# EAGLE design input (EAGLE 9.6.2)
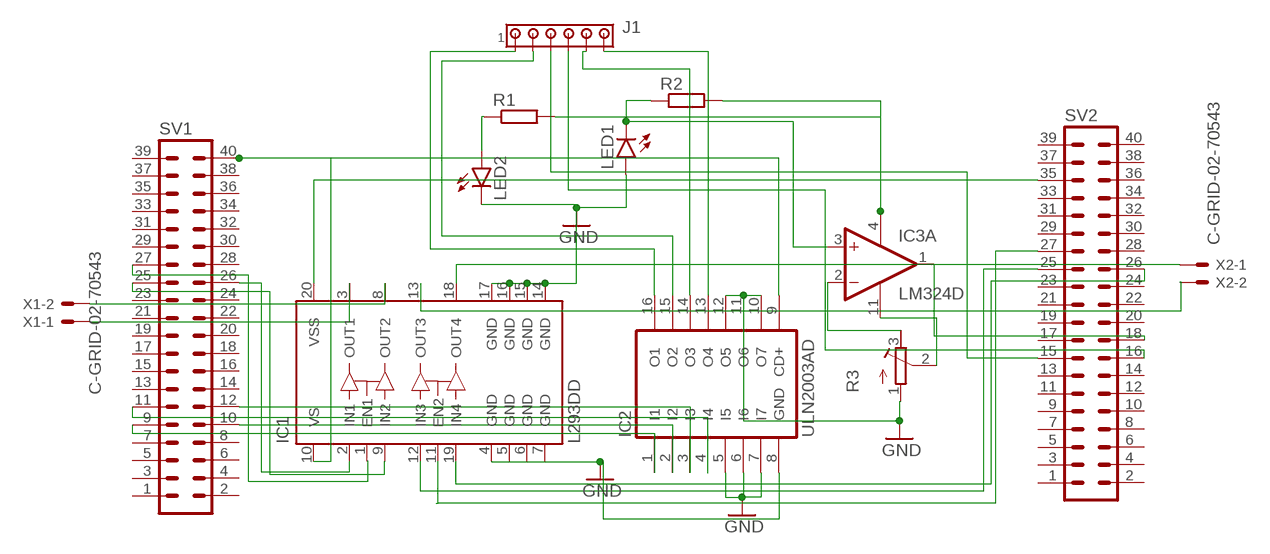
[diagram p0: schematic, sheet 1]

## Parts
IC1  L293DD  [SO20]
IC2  ULN2003AD  [SO16]
IC3  LM324D  [SO14]
J1  MTA06-100  [10X06MTA]
LED1  LED5MM  [LED5MM]
LED2  LED5MM  [LED5MM]
R1  R-EU_R0201  [R0201]
R2  R-EU_R0201  [R0201]
R3  R-TRIMM3103  [RTRIM3103]
SV1  40P  [40P]
SV2  40P  [40P]
X1  C-GRID-02-70543  [70543-02]
X2  C-GRID-02-70543  [70543-02]

## Nets
GND: IC1.4(GND) IC1.14(GND) IC1.15(GND) IC1.16(GND) IC1.17(GND) IC2.5(I5) IC2.6(I6) IC2.7(I7) IC2.8(GND) IC2.10(O7) IC2.11(O6) IC2.12(O5) LED1.A LED2.K(C) R3.1(A)
N$1: IC3.3(A:+IN) LED1.K(C) R2.1
N$2: LED2.A R1.1
N$3: IC3.11(P:V-) R3.2(S)
N$4: IC3.2(A:-IN) R3.3(E)
N$5: IC2.1(I1) SV1.9
N$6: IC2.2(I2) SV1.10
N$7: IC2.3(I3) SV1.12
N$8: IC1.2(IN1) SV1.26
N$9: IC1.9(IN2) SV1.25
N$10: IC1.1(EN1) SV1.27
N$11: IC1.12(IN3) SV2.25
N$12: IC1.19(IN4) SV2.26
N$13: IC1.11(EN2) SV2.27
N$14: IC1.3(OUT1) X1.1
N$15: IC1.8(OUT2) X1.2
N$16: IC1.10(VS) IC2.9(CD+) SV1.40
N$17: IC1.20(VSS) SV2.35
N$18: IC2.4(I4) SV1.11
N$19: IC1.18(OUT4) X2.1
N$20: IC1.13(OUT3) X2.2
N$21: IC2.16(O1) J1.1
N$22: IC2.15(O2) J1.2
N$23: IC2.14(O3) J1.5
N$24: IC2.13(O4) J1.6
N$25: IC3.4(P:V+) R1.2 R2.2
N$26: IC3.1(A:OUT) SV2.18
N$27: J1.3 SV2.15
N$28: J1.4 SV2.16
Unconnected: IC3.5(B:+IN) IC3.6(B:-IN) IC3.7(B:OUT) IC3.8(C:OUT) IC3.9(C:-IN) IC3.10(C:+IN) IC3.12(D:+IN) IC3.13(D:-IN) IC3.14(D:OUT) SV1.1 SV1.2 SV1.3 SV1.4 SV1.5 SV1.6 SV1.7 SV1.8 SV1.13 SV1.14 SV1.15 SV1.16 SV1.17 SV1.18 SV1.19 SV1.20 SV1.21 SV1.22 SV1.23 SV1.24 SV1.28 SV1.29 SV1.30 SV1.31 SV1.32 SV1.33 SV1.34 SV1.35 SV1.36 SV1.37 SV1.38 SV1.39 SV2.1 SV2.2 SV2.3 SV2.4 SV2.5 SV2.6 SV2.7 SV2.8 SV2.9 SV2.10 SV2.11 SV2.12 SV2.13 SV2.14 SV2.17 SV2.19 SV2.20 SV2.21 SV2.22 SV2.23 SV2.24 SV2.28 SV2.29 SV2.30 SV2.31 SV2.32 SV2.33 SV2.34 SV2.36 SV2.37 SV2.38 SV2.39 SV2.40

## Power pins joined to a net without a drawn wire
GND: IC1.5(GND) IC1.6(GND) IC1.7(GND)

## Library data of the parts
IC1 = st-microelectronics:L293DD: PUSH-PULL FOUR CHANNEL DRIVER WITH DIODES Source: http://www.st.com/stonline/books/pdf/docs/1330.pdf; OC_FARNELL: unknown
IC2 = uln-udn:ULN2003A: DRIVER ARRAY
IC3 = linear:LM324: OP AMP
J1 = con-amp:MTA06-100: AMP connector Connection corrected 2014-09-19
LED1 LED2 = led:LED: LED OSRAM: - CHIPLED LG R971, LG N971, LY N971, LG Q971, LY Q971, LO R971, LY R971 LH N974, LH R974 LS Q976, LO Q976, LY Q976 LO Q996 - Hyper CHIPLED LW Q18S LB Q993, LB Q99A, LB R99A - SideLED LS A670, LO A670, LY A670, LG A670, LP A670 LB A673, LV A673, LT A673, LW A673 LH A674 LY A675 LS A676, LA A676, LO A676, LY A676, LW A676 LS A679, LY A679, LG A679 - Hyper Micro SIDELED® LS Y876, LA Y876, LO Y876, LY Y876 LT Y87S - SmartLED LW L88C, LW L88S LB L89C, LB L89S, LG L890 LS L89K, LO L89K, LY L89K LS L896, LA L896, LO L896, LY L896 - TOPLED LS T670, LO T670, LY T670, LG T670, LP T670 LSG T670, LSP T670, LSY T670, LOP T670, LYG T670 LG T671, LOG T671, LSG T671 LB T673, LV T673, LT T673, LW T673 LH T674 LS T676, LA T676, LO T676, LY T676, LB T676, LH T676, LSB T676, LW T676 LB T67C, LV T67C, LT T67C, LS T67K, LO T67K, LY T67K, LW E67C LS E67B, LA E67B, LO E67B, LY E67B, LB E67C, LV E67C, LT E67C LW T67C LS T679, LY T679, LG T679 LS T770, LO T770, LY T770, LG T770, LP T770 LB T773, LV T773, LT T773, LW T773 LH T774 LS E675, LA E675, LY E675, LS T675 LS T776, LA T776, LO T776, LY T776, LB T776 LHGB T686 LT T68C, LB T68C - Hyper Mini TOPLED® LB M676 - Mini TOPLED Santana® LG M470 LS M47K, LO M47K, LY M47K Source: http://www.osram.convergy.de LUXEON: - LUMILED® LXK2-PW12-R00, LXK2-PW12-S00, LXK2-PW14-U00, LXK2-PW14-V00 LXK2-PM12-R00, LXK2-PM12-S00, LXK2-PM14-U00 LXK2-PE12-Q00, LXK2-PE12-R00, LXK2-PE12-S00, LXK2-PE14-T00, LXK2-PE14-U00 LXK2-PB12-K00, LXK2-PB12-L00, LXK2-PB12-M00, LXK2-PB14-N00, LXK2-PB14-P00, LXK2-PB14-Q00 LXK2-PR12-L00, LXK2-PR12-M00, LXK2-PR14-Q00, LXK2-PR14-R00 LXK2-PD12-Q00, LXK2-PD12-R00, LXK2-PD12-S00 LXK2-PH12-R00, LXK2-PH12-S00 LXK2-PL12-P00, LXK2-PL12-Q00, LXK2-PL12-R00 Source: www.luxeon.com KINGBRIGHT: KA-3528ASYC Source: www.kingbright.com
R1 R2 = rcl:R-EU_: RESISTOR, European symbol; SPICEPREFIX: R
R3 = rcl:R-TRIMM: Trimm resistor; SPICEMODEL: X; SPICEPREFIXL: POT
SV1 SV2 = con-dil:40P: DIL CABLE CONNECTOR
X1 X2 = con-molex:C-GRID-02: CONNECTOR wire to board 2.54 mm (0.100") pitch header; MF: MOLEX; OC_FARNELL: unknown; OC_NEWARK: unknown

## Board
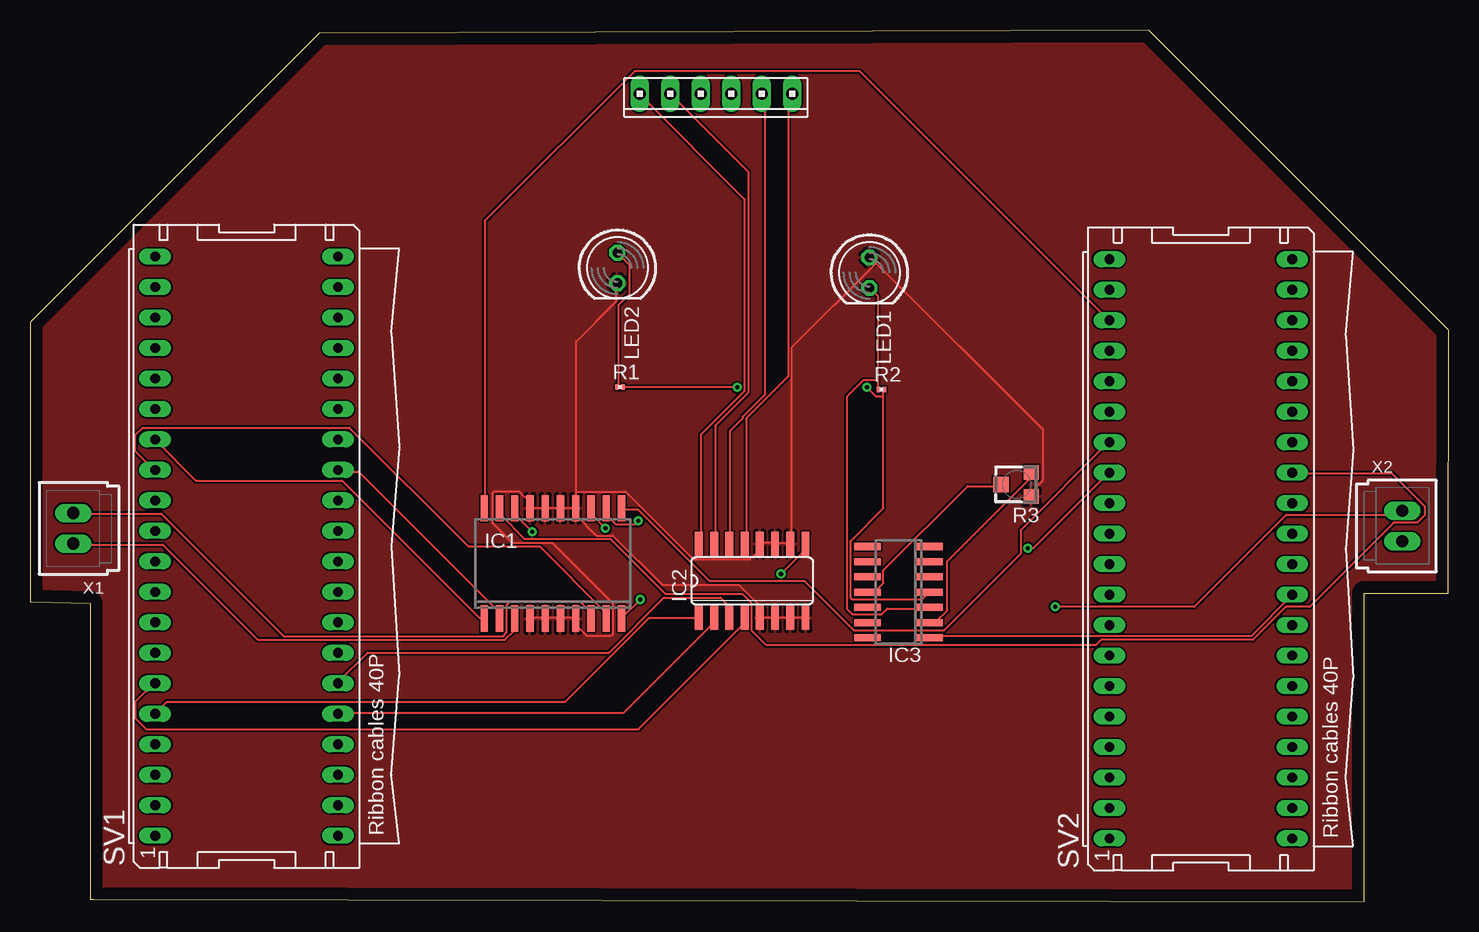
[diagram p1: board, top side]
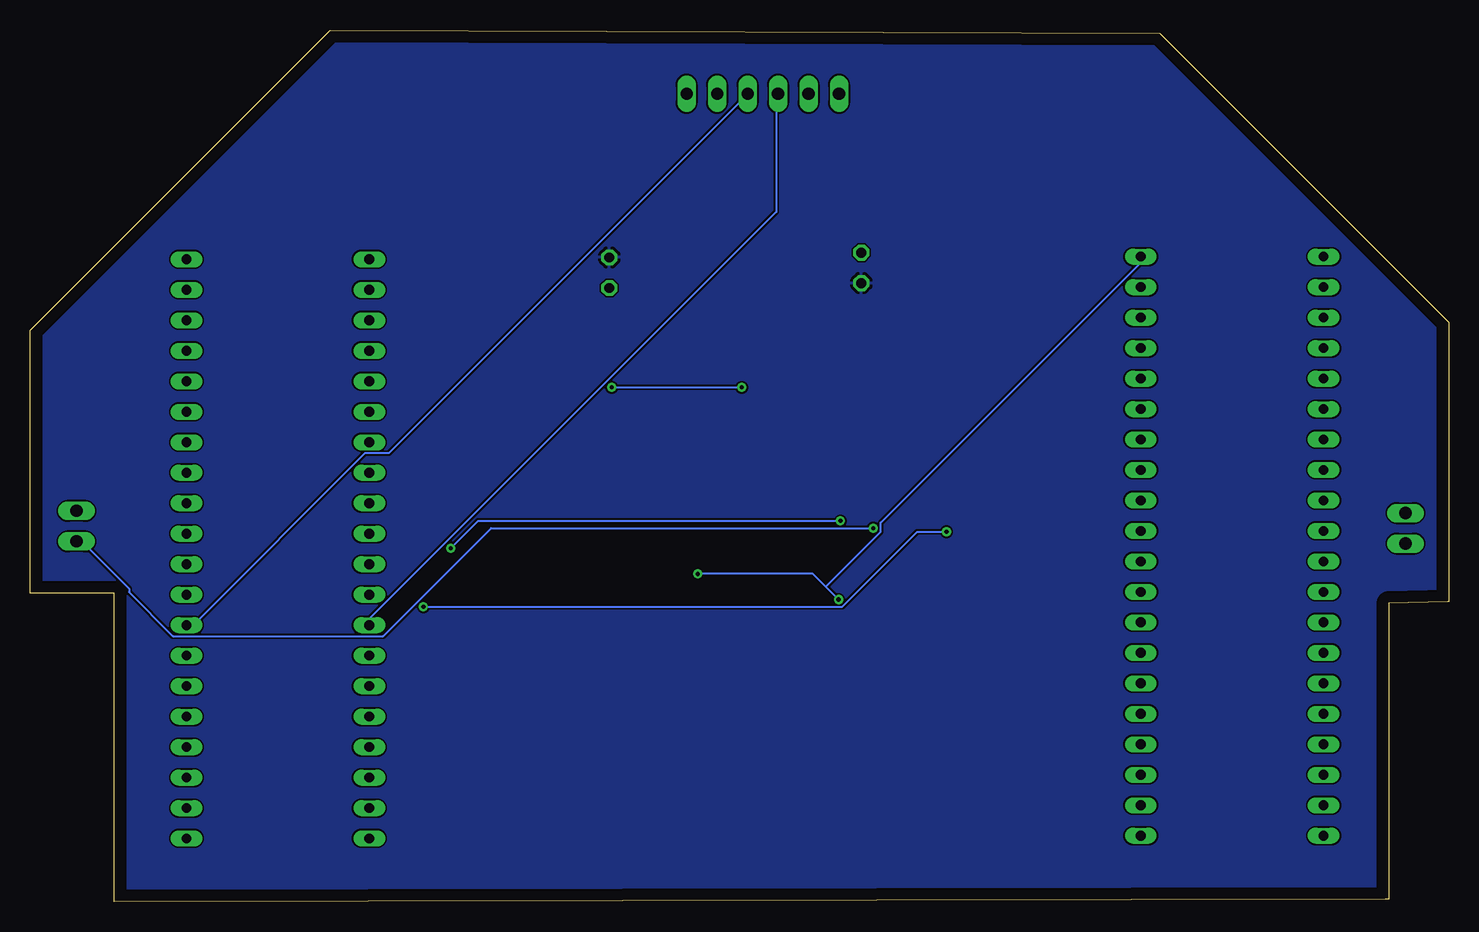
[diagram p2: board, bottom side, seen from below]

Size 118.23 x 72.65 mm. Coordinates in mm from the lower left corner, seen from the top.
Outline: 0,48.31 0,25 0.1,25 5,24.9 5,0.2 5.3,0.2 111.2,0 111.2,25.7 118.2,25.7 118.23,47.63 93.23,72.65 24.09,72.38 0,48.31
Copper layers (1*16): Top 0.035mm / dielectric 1.5mm / Bottom 0.035mm
Design rules "default": minimum track width 6mil, minimum drill 0.35mm, track to track 6mil, track to pad 6mil, pad to pad 6mil, via to via 6mil, smd to smd 6mil, copper to edge 40mil, drill to drill 6mil, minimum pad ring 10mil, minimum via ring 8mil, stop-mask expansion 4mil, vias tented up to drill 0mil, thermal gap 10mil

### Footprints (pad centres in the part's own frame; a part is rotated, then mirrored left to right if it is on the bottom)
SO20 = smd 0.6 x 2.2: 1 -5.715,-4.6; 2 -4.445,-4.6; 3 -3.175,-4.6; 4 -1.905,-4.6; 5 -0.635,-4.6; 6 0.635,-4.6; 7 1.905,-4.6; 8 3.175,-4.6; 9 4.445,-4.6; 10 5.715,-4.6; 11 5.715,4.6; 12 4.445,4.6; 13 3.175,4.6; 14 1.905,4.6; 15 0.635,4.6; 16 -0.635,4.6; 17 -1.905,4.6; 18 -3.175,4.6; 19 -4.445,4.6; 20 -5.715,4.6
SO16 = smd 0.66 x 2.032: 1 -4.445,-3.073; 2 -3.175,-3.073; 3 -1.905,-3.073; 4 -0.635,-3.073; 5 0.635,-3.073; 6 1.905,-3.073; 7 3.175,-3.073; 8 4.445,-3.073; 9 4.445,3.073; 10 3.175,3.073; 11 1.905,3.073; 12 0.635,3.073; 13 -0.635,3.073; 14 -1.905,3.073; 15 -3.175,3.073; 16 -4.445,3.073
SO14 = smd 0.6 x 2.2: 1 -3.81,-2.6; 2 -2.54,-2.6; 3 -1.27,-2.6; 4 0,-2.6; 5 1.27,-2.6; 6 2.54,-2.6; 7 3.81,-2.6; 8 3.81,2.6; 9 2.54,2.6; 10 1.27,2.6; 11 0,2.6; 12 -1.27,2.6; 13 -2.54,2.6; 14 -3.81,2.6
10X06MTA = drill 1.016 long: 1 6.35,0; 2 3.81,0; 3 1.27,0; 4 -1.27,0; 5 -3.81,0; 6 -6.35,0
LED5MM = drill 0.813 octagon: A -1.27,0; K 1.27,0
R0201 = smd 0.28 x 0.43: 1 -0.255,0; 2 0.255,0
RTRIM3103 = smd 1.2 x 1.25: 1 -1,-1.225; 3 1,-1.225 | smd 1.3 x 1.3: 2 0,1.3
40P = drill 0.813 long: 1 -24.13,7.62; 2 -24.13,-7.62; 3 -21.59,7.62; 4 -21.59,-7.62; 5 -19.05,7.62; 6 -19.05,-7.62; 7 -16.51,7.62; 8 -16.51,-7.62; 9 -13.97,7.62; 10 -13.97,-7.62; 11 -11.43,7.62; 12 -11.43,-7.62; 13 -8.89,7.62; 14 -8.89,-7.62; 15 -6.35,7.62; 16 -6.35,-7.62; 17 -3.81,7.62; 18 -3.81,-7.62; 19 -1.27,7.62; 20 -1.27,-7.62; 21 1.27,7.62; 22 1.27,-7.62; 23 3.81,7.62; 24 3.81,-7.62; 25 6.35,7.62; 26 6.35,-7.62; 27 8.89,7.62; 28 8.89,-7.62; 29 11.43,7.62; 30 11.43,-7.62; 31 13.97,7.62; 32 13.97,-7.62; 33 16.51,7.62; 34 16.51,-7.62; 35 19.05,7.62; 36 19.05,-7.62; 37 21.59,7.62; 38 21.59,-7.62; 39 24.13,7.62; 40 24.13,-7.62
70543-02 = drill 1.016 long: 1 -1.27,0; 2 1.27,0

### Placement (x,y rotation side)
IC1  43.57,28.2 0 top
IC2  60.18,26.75 0 top
IC3  72.38,25.81 90 top
J1  57.16,67.35 180 top
LED1  69.95,52.43 270 top
LED2  48.95,52.83 270 top
R1  49.16,42.9 0 top
R2  70.95,42.7 0 top
R3  82.22,34.78 90 top
SV1  18.05,29.64 90 top
SV2  97.57,29.41 90 top
X1  3.61,31.13 90 top
X2  114.35,31.32 270 top

### Tracks (layer width: path | path; a pad name or v marks a point on that pad's centre or on a via)
GND
  Top 0.152: 70.51,53.23 70.05,53.69 LED1.A | 70.51,53.23 84.38,39.37 84.38,35.1 83.46,34.19 83.46,33.88 R3.1 | IC1.4 41.7,23.67 42.92,23.67 IC1.5 43.08,23.67 44.14,23.67 IC1.6 44.3,23.67 45.36,23.67 IC1.7 45.52,23.52 45.52,23.06 46.43,22.15 48.41,22.15 48.56,22.3 48.56,24.89 43.53,29.92 40.18,29.92 38.51,31.59 38.51,34.03 38.66,34.19 40.79,34.19 41.55,33.42 41.55,32.81 IC1.17 41.7,32.81 42.92,32.81 IC1.16 43.08,32.81 44.14,32.81 IC1.15 44.3,32.81 45.36,32.81 IC1.14 | IC2.8 64.56,23.67 63.5,23.67 IC2.7 62.13,23.67 IC2.6 61.97,23.67 60.91,23.67 IC2.5 60.76,23.82 60.76,24.74 59.08,26.41 52.68,26.41 48.56,30.53 47.19,30.53 45.52,32.2 45.52,32.66 IC1.14 | 45.52,34.19 45.52,32.81 IC1.14 | 45.52,34.19 45.52,46.68 48.87,50.04 48.87,51.56 LED2.K | 45.52,34.19 49.63,34.19 55.27,28.55 59.99,28.55 60.76,29.31 60.76,29.77 IC2.12 60.91,29.92 61.97,29.92 IC2.11 62.13,29.92 63.35,29.92 IC2.10 63.5,29.92 63.5,46.23 70.51,53.23
  pour Top: -4.4,75.4 120,75.4 120,-1.9 -4.4,-1.9
  pour Bottom: -5.8,77.1 120.6,77.1 120.6,-3.2 -5.8,-3.2
N$1
  Top 0.152: 70.66,43.48 70.66,50.49 70.05,51.1 LED1.K | 70.66,43.48 70.66,42.72 R2.1 | 70.66,43.48 69.44,43.48 68.07,42.11 68.07,24.43 68.53,23.97 70.97,23.97 71.42,24.43 74.93,24.43 IC3.3
N$2
  Top 0.152: R1.1 49.02,43.02 49.02,49.73 49.94,50.64 49.94,53.08 49.02,54 LED2.A
N$3
  Top 0.152: R3.2 80.87,34.64 78.13,34.64 71.12,27.63 71.12,26.56 70.51,25.96 69.9,25.96 IC3.11
N$4
  Top 0.152: R3.3 83.31,35.71 83.31,35.25 76.45,28.39 76.45,24.28 75.54,23.36 75.08,23.36 IC3.2
N$5
  Top 0.152: IC2.1 51.61,23.67 44.6,16.66 11.38,16.66 10.46,15.74 SV1.9
N$6
  Top 0.152: IC2.2 56.95,23.67 56.95,23.21 49.48,15.74 25.7,15.74 SV1.10
N$7
  Top 0.152: IC2.3 58.16,23.82 58.16,24.74 57.55,25.35 52.83,25.35 48.26,20.77 28.14,20.77 25.7,18.34 SV1.12
N$8
  Top 0.152: IC1.2 39.11,23.67 39.11,24.13 27.38,35.86 25.7,35.86 SV1.26
N$9
  Top 0.152: IC1.9 47.95,23.67 47.95,24.13 42.47,29.61 36.52,29.61 26.62,39.52 9.4,39.52 8.79,38.91 8.79,37.54 10.31,36.01 SV1.25
N$10
  Top 0.152: IC1.1 37.74,23.67 37.44,23.67 26.01,35.1 13.82,35.1 10.46,38.45 SV1.27
N$11  (via drill 0.35)
  Top 0.152: v50.7,31.75 50.39,31.44 48.87,31.44 48.11,32.2 48.11,32.66 IC1.12 | v83.16,29.46 83.61,29.46 89.86,35.71 SV2.25
  Bottom 0.152: v50.7,31.75 80.87,31.75 v83.16,29.46
N$12
  Top 0.152: IC1.19 39.27,32.66 39.27,32.2 41.25,30.22 48.41,30.22 52.98,25.65 59.38,25.65 60.15,24.89 60.15,22.6 61.37,21.38 88.8,21.38 89.25,21.84 101.9,21.84 104.65,24.58 106.63,24.58 113.64,31.59 115.62,31.59 116.23,32.2 116.23,32.97 113.49,35.71 105.26,35.71 SV2.26
N$13
  Top 0.152: IC1.11 49.33,32.66 50.7,32.66 56.64,26.72 64.56,26.72 68.68,22.6 76.15,22.6 82.55,29 82.55,30.98 89.86,38.3 SV2.27
N$14
  Top 0.152: IC1.3 40.33,23.52 40.33,22.6 39.57,21.84 19,21.84 11.07,29.77 3.76,29.77 X1.1
N$15
  Top 0.152: IC1.8 46.73,23.67 46.73,24.13 45.82,25.04 40.03,25.04 39.72,24.74 39.72,22.45 39.42,22.15 21.13,22.15 10.92,32.36 3.76,32.36 X1.2
N$16  (via drill 0.35)
  Top 0.152: v62.58,27.33 64.56,29.31 64.56,29.77 IC2.9 | v50.85,25.19 49.33,23.67 IC1.10
  Bottom 0.152: v62.58,27.33 52.98,27.33 51.92,26.26 | v50.85,25.19 51.92,26.26 | 51.92,26.26 47.34,30.83 47.34,31.59 25.7,53.23 25.7,53.69 SV1.40
N$17
  Top 0.152: IC1.20 37.9,32.81 37.9,56.74 50.39,69.24 69.14,69.24 89.86,48.51 SV2.35
N$18
  Top 0.152: IC2.4 59.54,23.67 59.54,23.21 50.7,14.37 9.7,14.37 8.79,15.29 8.79,16.66 10.31,18.18 SV1.11
N$19  (via drill 0.35)
  Top 0.152: v41.86,30.83 40.49,32.2 40.49,32.66 IC1.18 | v85.44,24.58 97.03,24.58 104.65,32.2 113.94,32.2 114.25,32.51 X2.1
  Bottom 0.152: v41.86,30.83 44.3,30.83 50.54,24.58 v85.44,24.58
N$20  (via drill 0.35)
  Top 0.152: v47.95,31.14 46.89,32.2 46.89,32.66 IC1.13
  Bottom 0.152: v47.95,31.14 79.8,31.14 88.8,22.15 106.32,22.15 109.98,25.8 109.98,26.11 113.79,29.92 114.25,29.92 X2.2
N$21
  Top 0.152: IC2.16 55.88,29.92 55.88,38.91 59.54,42.57 59.54,58.57 50.85,67.26 J1.1
N$22
  Top 0.152: IC2.15 57.1,29.92 57.1,39.67 59.84,42.42 59.84,60.86 53.44,67.26 J1.2
N$23
  Top 0.152: IC2.14 58.32,29.92 58.32,39.21 59.38,40.28 59.38,40.43 61.21,42.26 61.21,67.1 61.06,67.26 J1.5
N$24
  Top 0.152: IC2.13 59.69,29.92 59.69,40.28 63.19,43.79 63.19,66.95 63.5,67.26 J1.6
N$25  (via drill 0.35)
  Top 0.152: 71.12,42.11 71.12,32.81 68.38,30.07 68.38,25.35 68.53,25.19 74.32,25.19 74.93,25.8 IC3.4 | 71.12,42.11 71.12,42.57 R2.2 | v58.93,42.87 49.48,42.87 R1.2 | v69.75,42.87 70.51,42.11 71.12,42.11
  Bottom 0.152: v69.75,42.87 v58.93,42.87
N$26
  Top 0.152: IC3.1 75.08,22.15 101.75,22.15 105.1,25.5 SV2.18
N$27
  Bottom 0.152: SV2.15 89.86,23.06 89.86,23.67 56.03,57.5 56.03,67.26 J1.3
N$28
  Bottom 0.152: SV2.16 104.65,23.06 90.32,37.39 88.34,37.39 58.47,67.26 J1.4